# Altium schematic sheet External ADC.SchDoc
size A
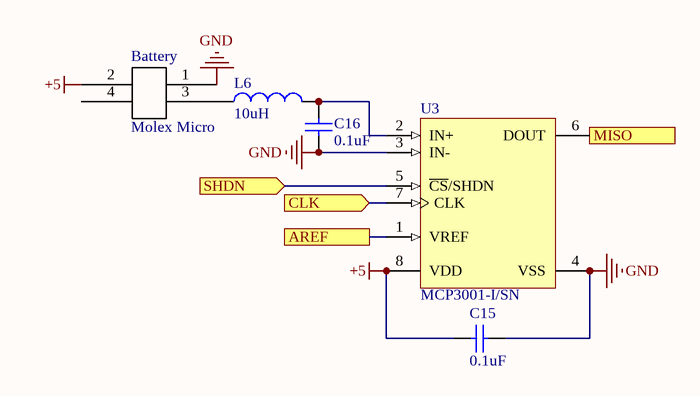
[diagram p0: External ADC.SchDoc]

## Parts
Battery  Molex Micro  [0430450427]
C15  0.1uF  [CAPC2013X94X50LL20T25]
C16  0.1uF  [CAPC2013X94X50LL20T25]
L6  10uH  [TDK-IND0805-125_V]
U3  MCP3001-I/SN  [SOIC-SN8_M]

## Ports
AREF, CLK (in), MISO (out), SHDN (in)

## Nets
+5: Battery.2 C15.2 U3.8(VDD)
GND: Battery.1 C15.1 C16.1 U3.3(IN-) U3.4(VSS)
AREF: U3.1(VREF) ; port AREF
CLK: U3.7(CLK) ; port CLK
MISO: U3.6(DOUT) ; port MISO
SHDN: U3.5(~{CS}/SHDN) ; port SHDN
NetBattery_3: Battery.3 L6.1
NetC16_2: C16.2 L6.2 U3.2(IN+)

Not connected (* = marked no-connect by the designer): Battery 4

## Library data of the parts
Battery = Molex micro-fit 4-pin (dual row schematic): Molex micro-fit 3.0, P/N 0430450427
C15 C16 = CMP-2000-05808-1: Chip Capacitor, 0.1 uF, +/- 5%, 50 V, -55 to 125 degC, 0805 (2012 Metric), RoHS, Tape and Reel; Case Width: 1.25mm; Case Length: 2.01mm; Case Height: 0.94mm; Brand: AVX; Type: StandardX7RMLCCs; Capacitance - nF: 100nF; Dissipation Factor DF: 2.5; Voltage Rating DC: 50V; Temperature Coefficient / Code: +/-15%; Capacitance - pF: 100000pF; Dielectric: X7R; Dimensions: 1.25mmWx2.01mmLx0.94mmH; Product: GeneralTypeMLCCs; Package Description: 2-Pin Surface Mount Device, Body 2.01 x 1.25 mm; Capacitance: 0.1uF; Package / Case: 0805(2012metric); Product Category: MultilayerCeramicCapacitorsMLCC-SMD/SMT; Case Code - mm: 2012; Packaging: Reel; Manufacturer URL: http://www.avx.com/; Operating Temperature Range: -55Cto+125C; Termination Style: SMD/SMT; Maximum Operating Temperature: +125C; Case Code - in: 0805; Minimum Operating Temperature: -55C; Factory Pack Quantity: 4000; RoHS: Details; Voltage Rating: 50V; Tolerance: 5%; Package Reference: 0805; Datasheet URL: http://www.farnell.com/datasheets/1679506.pdf; Manufacturer: AVX; Mounting Technology: SurfaceMount; Datasheet Version: 11/2012
L6 = CMP-0266-00001-1: Multilayer Inductor, 10 uH, ±20%, 300 mOhm, 50MHz, 0805(2012); PartNumber: MLZ2012N100LT; DC Resistance: 0.3 Ohm; PackageReference: IND0805-125; ComponentLink1URL: http://www.global.tdk.com/; DatasheetVersion: 05/2013; ComponentLink2Description: Datasheet; ComponentLink1Description: Manufacturer URL; Mounting Technology: Suface Mount; ComponentLink2URL: http://www.tdk.co.jp/tcfx01/c533_mlz.pdf; PackageDescription: 2-Pin SMT Inductor, 2 x 1.25 mm Body
U3 = CMP-0188-00515-1: 2.7V 10-Bit A/D Converter with SPI Serial Interface, 8-Pin SOIC 150mil, Industrial Temperature; PackageReference: SOIC-SN8; DatasheetVersion: revC, Jan-2007; Code_IPC: SOIC127P600-8; Code_JEDEC: MS-012; PackageDescription: 8-Lead Plastic Small Outline (SN) - Narrow, 3.90mm Body [SOIC]; PackageVersion: revBB, Aug-2009